# EAGLE design SD breakout (EAGLE 5.06)
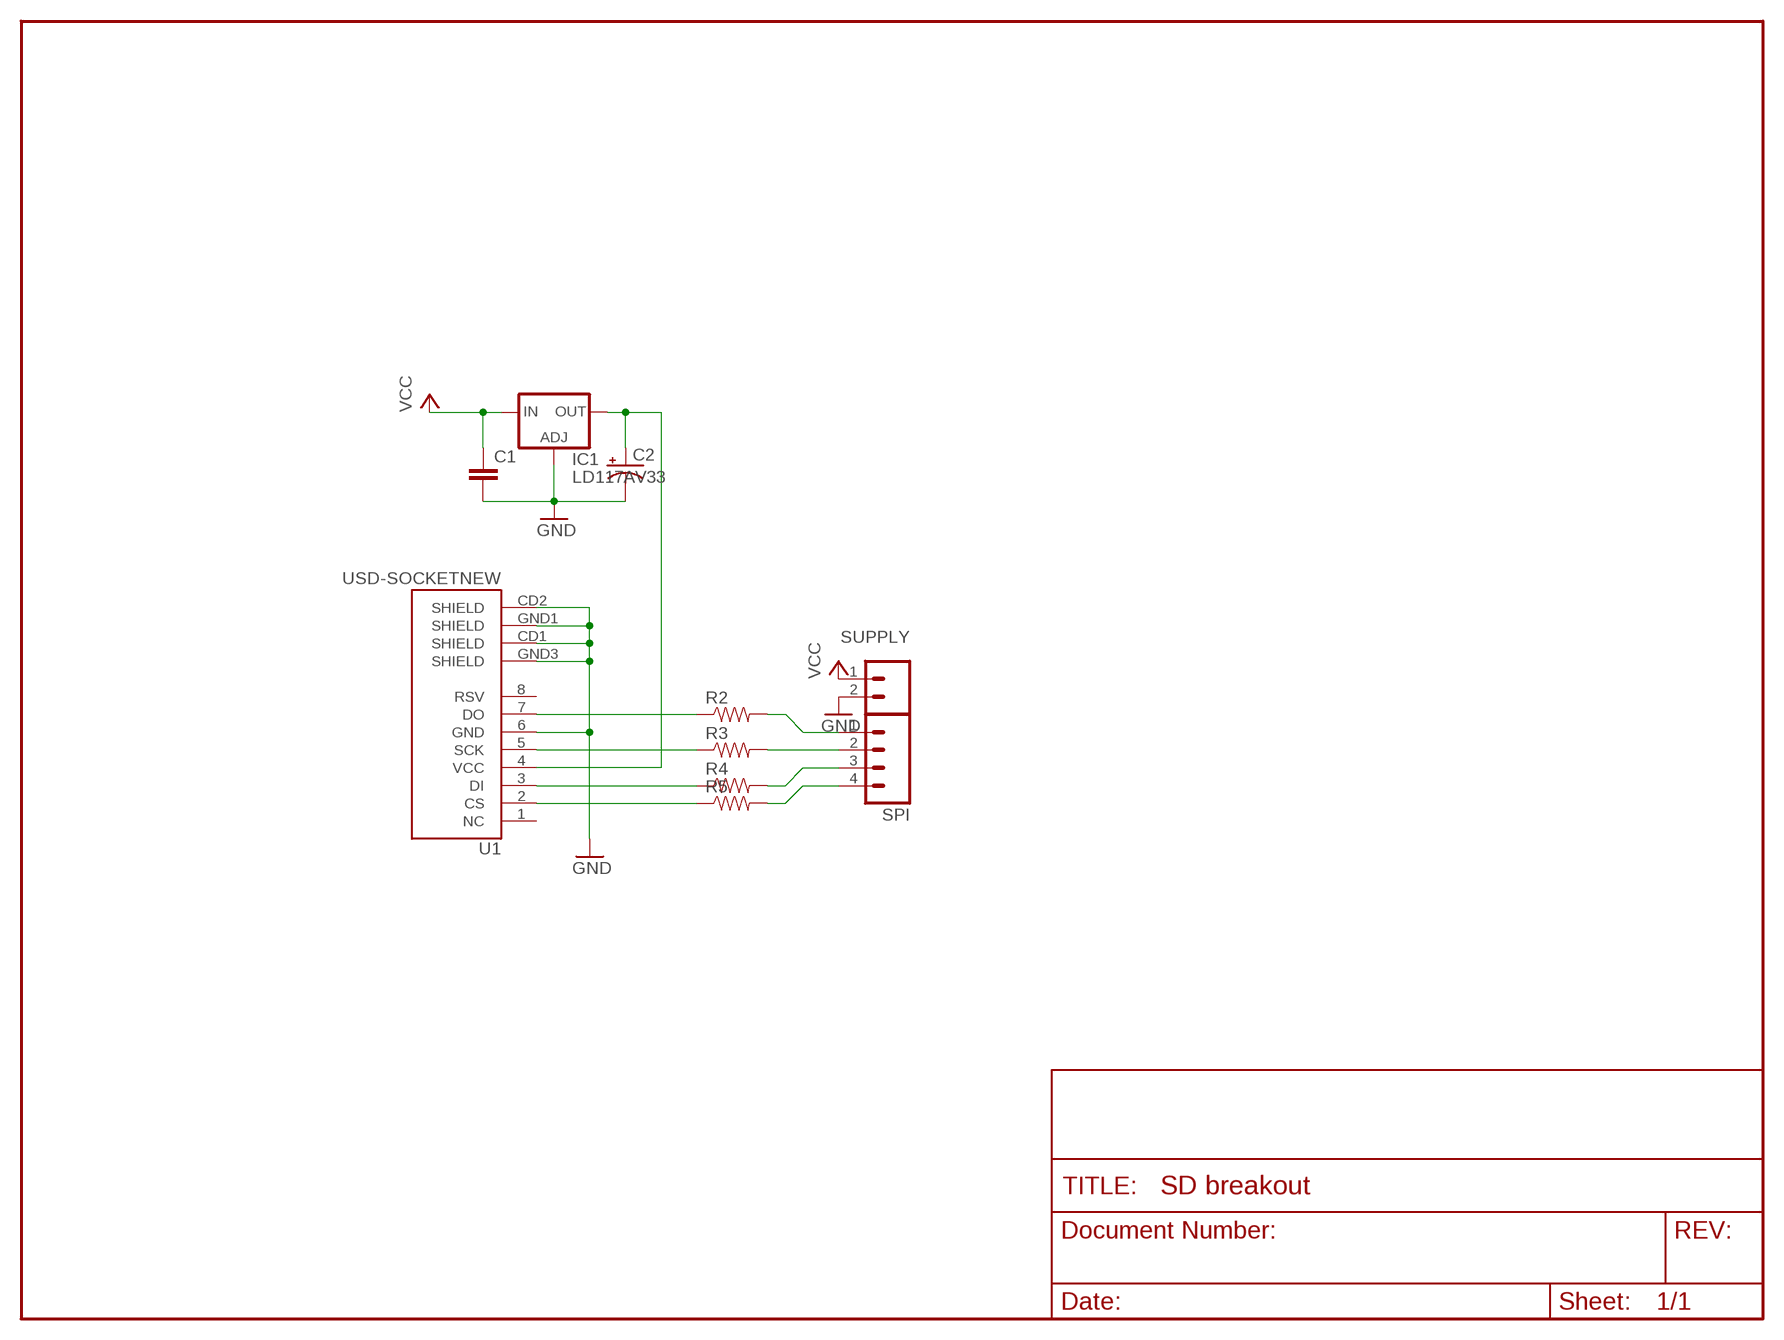
[diagram p0: schematic, sheet 1]

## Parts
C1  CAPPTH1  [CAP-PTH-5MM]
C2  CAP_POLPTH2  [CPOL-RADIAL-10UF-25V]
IC1  LD117AV33  [TO220L1]
R2  RESISTORPTH1  [AXIAL-0.3]
R3  RESISTORPTH1  [AXIAL-0.3]
R4  RESISTORPTH1  [AXIAL-0.3]
R5  RESISTORPTH1  [AXIAL-0.3]
SPI  M04LOCK  [1X04_LOCK]
SUPPLY  M02LOCK  [1X02_LOCK]
U1  USD-SOCKETNEW  [MICRO-SD-SOCKET-PP]

## Nets
GND: C1.2 C2.2(-) IC1.1(ADJ) SUPPLY.2 U1.6(GND) U1.CD1(SHIELD) U1.CD2(SHIELD) U1.GND1(SHIELD) U1.GND3(SHIELD)
N$1: R2.P$2 SPI.1
N$2: R2.P$1 U1.7(DO)
N$3: C2.1(+) IC1.2(OUT) U1.4(VCC)
N$4: R3.P$1 U1.5(SCK)
N$5: R4.P$1 U1.3(DI)
N$6: R5.P$1 U1.2(CS)
N$7: R3.P$2 SPI.2
N$8: R4.P$2 SPI.3
N$9: R5.P$2 SPI.4
VCC: C1.1 IC1.3(IN) SUPPLY.1
Unconnected: U1.1(NC) U1.8(RSV)

## Library data of the parts
C1 = SparkFun:CAP: Capacitor Standard 0603 ceramic capacitor, and 0.1" leaded capacitor.
C2 = SparkFun:CAP_POL: Capacitor Polarized These are standard SMD and PTH capacitors. Normally 10uF, 47uF, and 100uF in electrolytic and tantalum varieties. Always verify the external diameter of the through hole cap, it varies with capacity, voltage, and manufacturer. The EIA devices should be standard.
IC1 = v-reg:LD117A?*: Low drop fixed and adjustable positive voltage regulators 1 A Source: http://www.st.com/stonline/products/literature/ds/7194/ld1117axx.pdf
R2-R5 = SparkFun:RESISTOR: Resistor Basic schematic elements and footprints for 0603, 1206, and PTH 1/10th watt (small) resistors.
SPI = SparkFun:M04: Header 4 Standard 4-pin 0.1" header. Use with straight break away headers (SKU : PRT-00116), right angle break away headers (PRT-00553), swiss pins (PRT-00743), machine pins (PRT-00117), and female headers (PRT-00115). Molex polarized connector foot print use with SKU : PRT-08231 with associated crimp pins and housings.
SUPPLY = SparkFun:M02: Header 2 Standard 2-pin 0.1" header. Use with straight break away headers (SKU : PRT-00116), right angle break away headers (PRT-00553), swiss pins (PRT-00743), machine pins (PRT-00117), and female headers (PRT-00115). Molex polarized connector foot print use with SKU : PRT-08233 with associated crimp pins and housings.
U1 = SparkFun:USD-SOCKET: microSD Socket Push-push type uSD socket. Schematic element and footprint production proven. Spark Fun Electronics SKU : PRT-00127. tDoc lines correctly indicate media card edge positions when inserting (unlocked, locked, depressed).

## Board
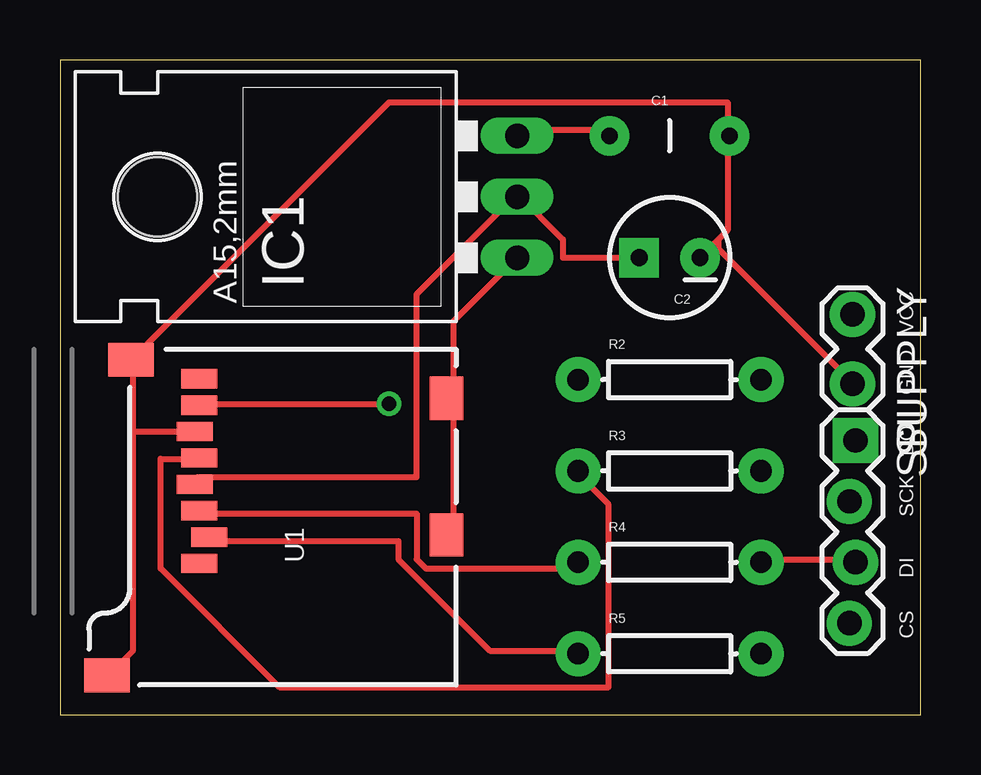
[diagram p1: board, top side]
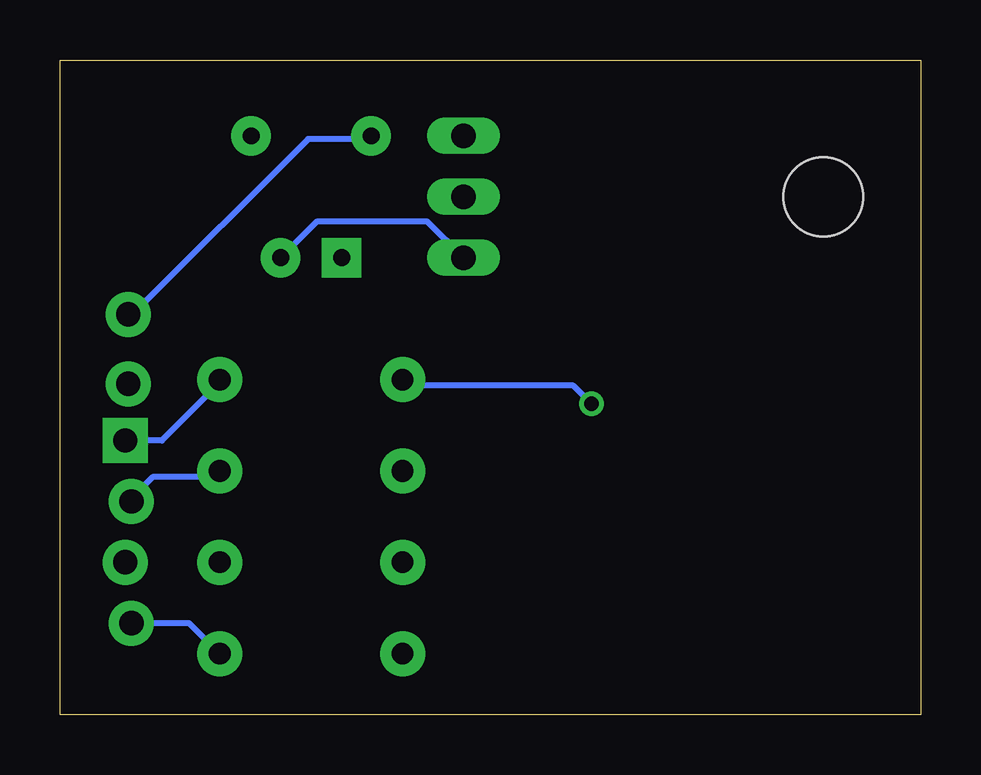
[diagram p2: board, bottom side, seen from below]

Size 35.87 x 27.3 mm. Coordinates in mm from the lower left corner, seen from the top.
Outline: 0,0 35.87,0 35.87,27.3 0,27.3 0,0
Copper layers (1*16): Top 0.035mm / dielectric 1.5mm / Bottom 0.035mm
Design rules "default": minimum track width 10mil, minimum drill 24mil, track to track 8mil, track to pad 8mil, pad to pad 8mil, via to via 8mil, smd to smd 8mil, copper to edge 40mil, drill to drill 8mil, minimum pad ring 10mil, minimum via ring 8mil, stop-mask expansion 4mil, vias tented up to drill 0mil, thermal gap 10mil

### Footprints (pad centres in the part's own frame; a part is rotated, then mirrored left to right if it is on the bottom)
CAP-PTH-5MM = drill 0.7 pad 1.651 round: 1 -2.5,0; 2 2.5,0
CPOL-RADIAL-10UF-25V = drill 0.7 pad 1.651 square: 1 1.27,0 | drill 0.7 pad 1.651 round: 2 -1.27,0
TO220L1 = drill 1.016 long: 1 -2.54,-3.81; 2 0,-3.81; 3 2.54,-3.81 | hole 3.302: 0,11.176
AXIAL-0.3 = drill 0.9 pad 1.88 round: P$1 -3.81,0; P$2 3.81,0
1X04_LOCK = drill 1.016 pad 1.88 square: 1 0,0.127 | drill 1.016 pad 1.88 round: 2 2.54,-0.127; 3 5.08,0.127; 4 7.62,-0.127
1X02_LOCK = drill 1.016 pad 1.88 round: 1 -0.178,0; 2 2.718,0
MICRO-SD-SOCKET-PP = smd 0.8 x 1.5: 1 -8.94,10.7; 2 -7.84,10.3; 3 -6.74,10.7; 4 -5.64,10.9; 5 -4.54,10.7; 6 -3.44,10.9; 7 -2.34,10.7; 8 -1.24,10.7 | smd 1.8 x 1.4: CD1 -2.05,0.4; CD2 -7.75,0.4 | smd 1.4 x 1.9: GND1 -13.6,14.55; GND3 -0.45,13.55

### Placement (x,y rotation side)
C1  25.4,24.13 0 top
C2  25.4,19.05 180 top
IC1  15.24,21.59 90 top
R2  25.4,13.97 0 top
R3  25.4,10.16 0 top
R4  25.4,6.35 0 top
R5  25.4,2.54 0 top
SPI  33.02,11.43 270 top
SUPPLY  33.02,16.51 270 top
U1  16.51,15.24 90 top

### Tracks (layer width: path | path; a pad name or v marks a point on that pad's centre or on a via)
GND
  Top 0.254: 3.05,11.81 5.33,11.81 U1.6 | 3.05,11.81 3.05,14.48 U1.GND3 3.05,14.86 13.72,25.53 27.81,25.53 27.81,24.38 C1.2 27.81,24 27.81,20.19 27.43,19.81 | 3.05,11.81 3.05,2.67 2.29,1.91 U1.GND1 | U1.CD2 16.38,7.62 16.38,12.95 U1.CD1 16.38,13.34 16.38,16.38 IC1.1 | 27.43,19.81 C2.2 | 27.43,19.81 27.43,19.43 32.77,14.1 SUPPLY.2
  Bottom 0.254: IC1.1 20.57,20.57 25.15,20.57 C2.2
N$1
  Bottom 0.254: SPI.1 31.62,11.43 29.34,13.72 R2.P$2
N$2  (via drill 0.61)
  Top 0.254: v13.72,12.95 6.1,12.95 U1.7
  Bottom 0.254: v13.72,12.95 14.48,13.72 21.34,13.72 R2.P$1
N$3
  Top 0.254: 19.05,21.72 14.86,17.53 14.86,9.91 5.71,9.91 U1.4 | 19.05,21.72 20.95,19.81 20.95,19.05 C2.1 | 19.05,21.72 IC1.2
N$4
  Top 0.254: U1.5 5.71,10.67 4.19,10.67 4.19,6.1 9.14,1.14 22.86,1.14 22.86,8.76 21.72,9.91 R3.P$1
N$5
  Top 0.254: U1.3 6.1,8.38 14.86,8.38 14.86,6.48 15.24,6.1 21.34,6.1 R4.P$1
N$6
  Top 0.254: U1.2 6.48,7.24 14.1,7.24 14.1,6.48 17.91,2.67 21.34,2.67 R5.P$1
N$7
  Bottom 0.254: SPI.2 32.77,9.14 32,9.91 29.34,9.91 R3.P$2
N$8
  Top 0.254: R4.P$2 29.34,6.48 33.15,6.48 SPI.3
N$9
  Bottom 0.254: R5.P$2 30.48,3.81 SPI.4
VCC
  Top 0.254: IC1.3 19.05,24.38 22.86,24.38 C1.1
  Bottom 0.254: SUPPLY.1 32.77,16.76 25.53,24 23.24,24 C1.1

### Text on the board
tPlace: VCC | GND | DO | SCK | DI | CS